# EAGLE design SparkFun_Gainer_PSoC_Dev_Board (EAGLE 7.2.0)
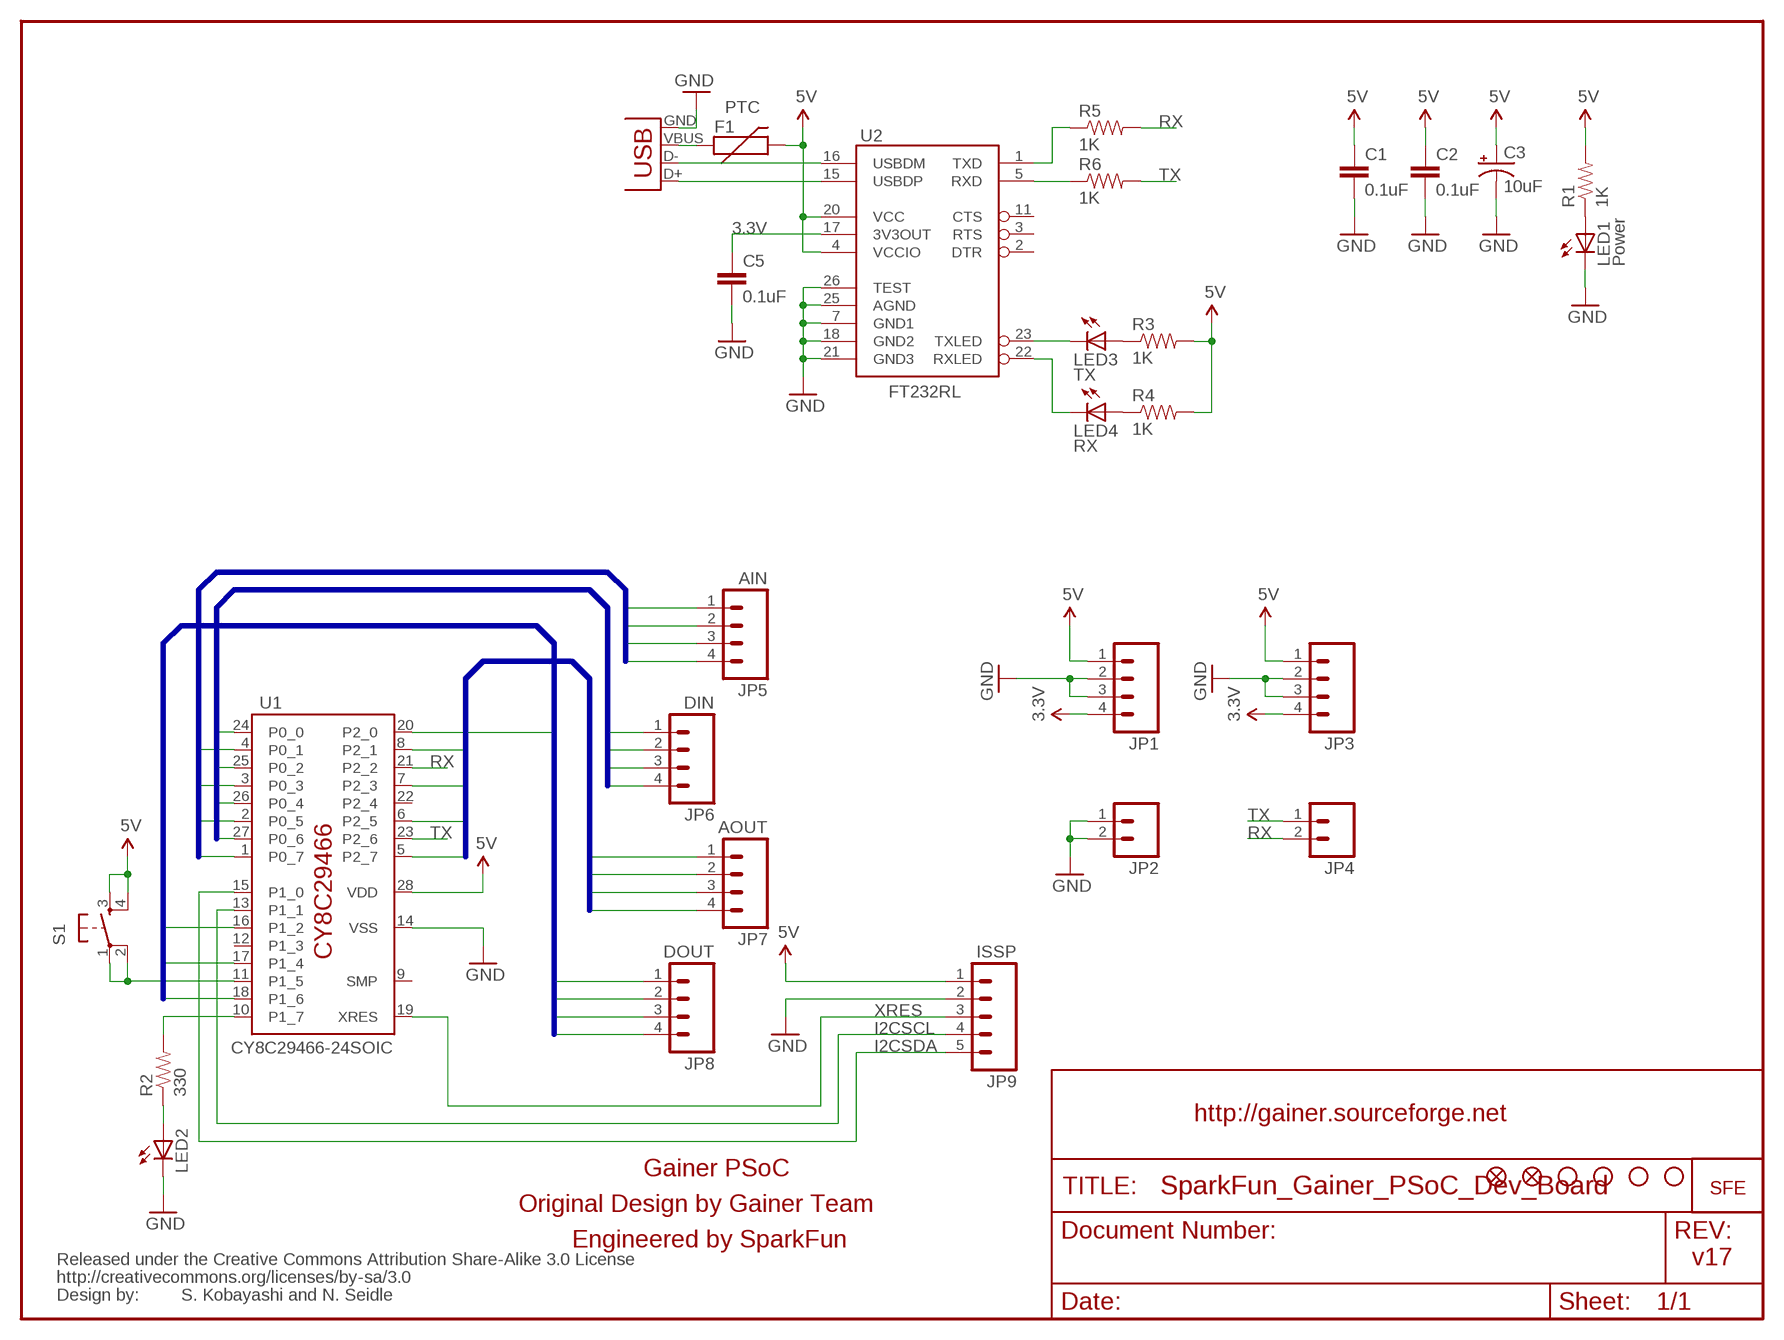
[diagram p0: schematic, sheet 1]

## Parts
C1  0.1uF  CAP0402  [C0402]
C2  0.1uF  CAP0402  [C0402]
C3  10uF  CAP_POL1206  [EIA3216]
C5  0.1uF  CAP0402  [C0402]
F1  PTC  PTCSMD  [PTC-1206]
JP1  M04PTH  [1X04]
JP2  M02PTH  [1X02]
JP3  M04PTH  [1X04]
JP4  M02PTH  [1X02]
JP5  AIN  M04PTH  [1X04]
JP6  DIN  M04PTH  [1X04]
JP7  AOUT  M04PTH  [1X04]
JP8  DOUT  M04PTH  [1X04]
JP9  ISSP  M05  [1X05]
LED1  Power  LED1206  [LED-1206]
LED2  LED1206  [LED-1206]
LED3  TX  LED0603  [LED-0603]
LED4  RX  LED0603  [LED-0603]
R1  1K  RESISTOR0402  [C0402]
R2  330  RESISTOR0402  [C0402]
R3  1K  RESISTOR0402  [C0402]
R4  1K  RESISTOR0402  [C0402]
R5  1K  RESISTOR0402  [C0402]
R6  1K  RESISTOR0402  [C0402]
S1  TAC_SWITCHSMD  [TACTILE_SWITCH_SMD]
U1  CY8C29466-24SOIC  [SOIC28]
U2  FT232RL  FT232RL-BASICSSOP  [SSOP28DB]
U$1  LOGO-SFENEW  [SFE-NEW-WEBLOGO]
U$10  FIDUCIAL1X2  [FIDUCIAL-1X2]
U$12  STAND-OFF  [STAND-OFF]
U$13  STAND-OFF  [STAND-OFF]
U$14  STAND-OFF  [STAND-OFF]
U$15  STAND-OFF  [STAND-OFF]
U$17  FIDUCIAL1X2  [FIDUCIAL-1X2]
U$18  CREATIVE_COMMONS  [CREATIVE_COMMONS]
X2  USBSMD  [USB-MINIB]

## Nets
3.3V: C5.1 JP1.4 JP3.4 U2.17(3V3OUT)
5V: C1.1 C2.1 C3.A(+) F1.2 JP1.1 JP3.1 JP9.1 R1.2 R3.2 R4.2 S1.3 S1.4 U1.28(VDD) U2.4(VCCIO) U2.20(VCC)
AIN1: JP5.1 U1.1(P0_7)
AIN2: JP5.2 U1.2(P0_5)
AIN3: JP5.3 U1.3(P0_3)
AIN4: JP5.4 U1.4(P0_1)
AOUT1: JP7.1 U1.5(P2_7)
AOUT2: JP7.2 U1.6(P2_5)
AOUT3: JP7.3 U1.7(P2_3)
AOUT4: JP7.4 U1.8(P2_1)
DIN1: JP6.1 U1.27(P0_6)
DIN2: JP6.2 U1.26(P0_4)
DIN3: JP6.3 U1.25(P0_2)
DIN4: JP6.4 U1.24(P0_0)
DOUT1: JP8.1 U1.20(P2_0)
DOUT2: JP8.2 U1.18(P1_6)
DOUT3: JP8.3 U1.17(P1_4)
DOUT4: JP8.4 U1.16(P1_2)
GND: C1.2 C2.2 C3.C(-) C5.2 JP1.2 JP1.3 JP2.1 JP2.2 JP3.2 JP3.3 JP9.2 LED1.C LED2.C U1.14(VSS) U2.7(GND1) U2.18(GND2) U2.21(GND3) U2.25(AGND) U2.26(TEST) X2.GND
I2CSCL: JP9.4 U1.13(P1_1)
I2CSDA: JP9.5 U1.15(P1_0)
N$1: LED3.A R3.1
N$2: F1.1 X2.VBUS
N$4: LED1.A R1.1
N$5: LED4.A R4.1
N$6: R6.1 U2.5(RXD)
N$7: LED4.C U2.22(RXLED)
N$8: S1.1 S1.2 U1.11(P1_5)
N$9: R2.2 U1.10(P1_7)
N$10: LED2.A R2.1
N$11: U2.16(USBDM) X2.D-
N$13: U2.15(USBDP) X2.D+
N$16: R5.1 U2.1(TXD)
N$17: LED3.C U2.23(TXLED)
RX: JP4.2 R5.2 U1.21(P2_2)
TX: JP4.1 R6.2 U1.23(P2_6)
XRES: JP9.3 U1.19(XRES)
Unconnected: U1.9(SMP) U1.12(P1_3) U1.22(P2_4) U2.2(DTR) U2.3(RTS) U2.11(CTS)

## Buses
AIN[1..4]
DIN[1..4]
AOUT[1..4]
DOUT[1..4]

## Notes on the sheet
- http://gainer.sourceforge.net
- Gainer PSoC
- Original Design by Gainer Team
- Engineered by SparkFun
- v17
- S. Kobayashi and N. Seidle

## Library data of the parts
C1 C2 C5 = SparkFun:CAP: Capacitor Standard 0603 ceramic capacitor, and 0.1" leaded capacitor.
C3 = SparkFun:CAP_POL: Capacitor Polarized These are standard SMD and PTH capacitors. Normally 10uF, 47uF, and 100uF in electrolytic and tantalum varieties. Always verify the external diameter of the through hole cap, it varies with capacity, voltage, and manufacturer. The EIA devices should be standard.
F1 = SparkFun:PTC: Resettable Fuse PTC Resettable Fuse. Spark Fun Electronics SKU : COM-08357
JP1 JP3 JP5-JP8 = SparkFun:M04: Header 4 Standard 4-pin 0.1" header. Use with straight break away headers (SKU : PRT-00116), right angle break away headers (PRT-00553), swiss pins (PRT-00743), machine pins (PRT-00117), and female headers (PRT-00115). Molex polarized connector foot print use with SKU : PRT-08231 with associated crimp pins and housings.
JP2 JP4 = SparkFun:M02: Header 2 Standard 2-pin 0.1" header. Use with straight break away headers (SKU : PRT-00116), right angle break away headers (PRT-00553), swiss pins (PRT-00743), machine pins (PRT-00117), and female headers (PRT-00115). Molex polarized connector foot print use with SKU : PRT-08233 with associated crimp pins and housings.
JP9 = SparkFun:M05: Header 5 Standard 5-pin 0.1" header. Use with straight break away headers (SKU : PRT-00116), right angle break away headers (PRT-00553), swiss pins (PRT-00743), machine pins (PRT-00117), and female headers (PRT-00115). Molex polarized connector foot print use with SKU : PRT-08230 with associated crimp pins and housings.
LED1-LED4 = SparkFun:LED: LEDs Standard schematic elements and footprints for 5mm, 3mm, 1206, and 0603 sized LEDs. 5mm - Spark Fun Electronics SKU : COM-00529 (and others)
R1-R6 = SparkFun:RESISTOR: Resistor Basic schematic elements and footprints for 0603, 1206, and PTH 1/10th watt (small) resistors.
S1 = SparkFun:TAC_SWITCH: Momentary Switch Button commonly used for reset or general input. Spark Fun Electronics SKU : COM-00097
U1 = cypress-psoc:CY8C29466-24*
U2 = SparkFun:FT232RL-BASIC: USB UART This is the simplified version of the FT232RL unit. Only what you need, nothing you don't. Spark Fun Electronics SKU : COM-00650
U$1 = SparkFun:LOGO-SFE: Spark Fun Electronics PCB Logo This is the standard Spark Fun Electronics PCB logo.
U$10 U$17 = SparkFun:FIDUCIAL: Fiducial Alignment Points Various fiducial points for machine vision alignment.
U$12-U$15 = SparkFun:STAND-OFF: Stand Off This is the mechanical footprint for a #4 phillips button head screw. Use the keepout ring to avoid running the screw head into surrounding components. SKU : PRT-00447
U$18 = SparkFun:CREATIVE_COMMONS
X2 = SparkFun:USB: USB Connectors USB-B-PTH is fully proven SKU : PRT-00139 USB-miniB is fully proven SKU : PRT-00587 USB-A-PCB is untested. USB-A-H is throughly reviewed, but untested. Spark Fun Electronics SKU : PRT-00437 USB-B-SMT is throughly reviewed, but untested. Needs silkscreen touching up. USB-A-S has not been used/tested USB-MB-H has not been used/tested

## Net classes
1 +5v: width 0.813 mm
2 GND: width 0.813 mm

## Board
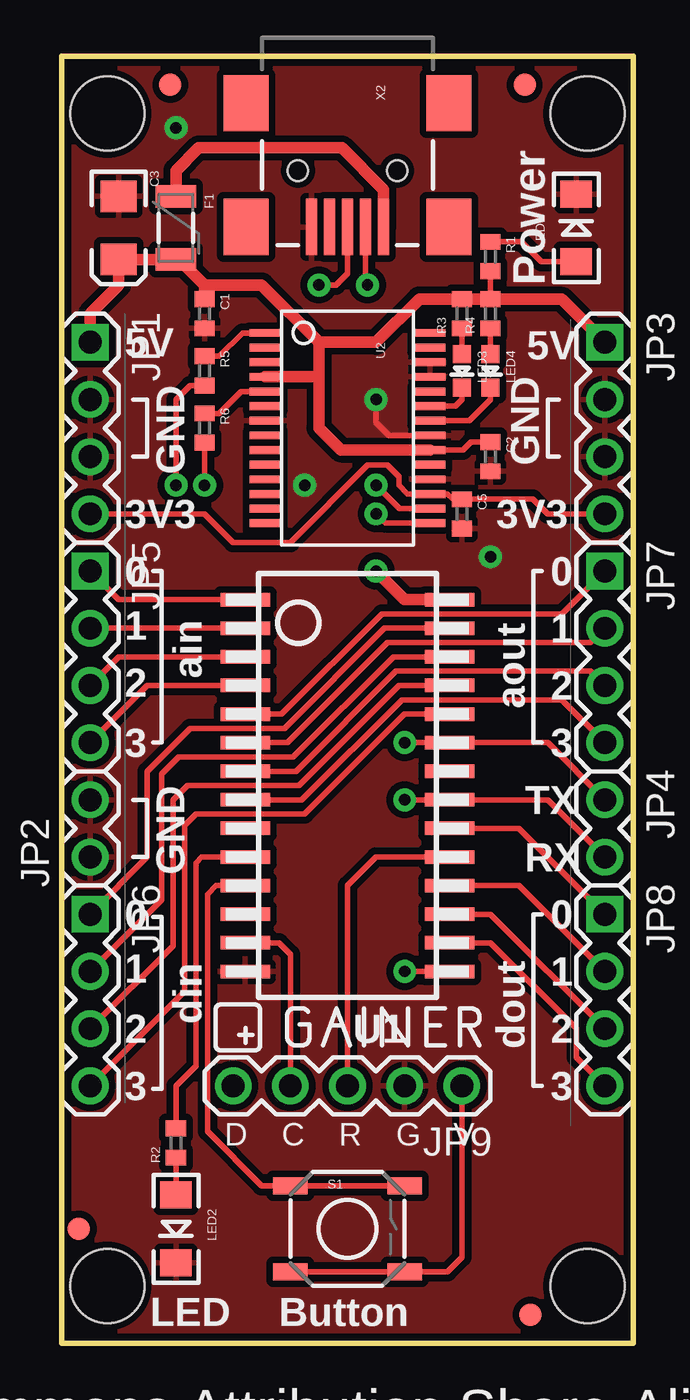
[diagram p1: board, top side]
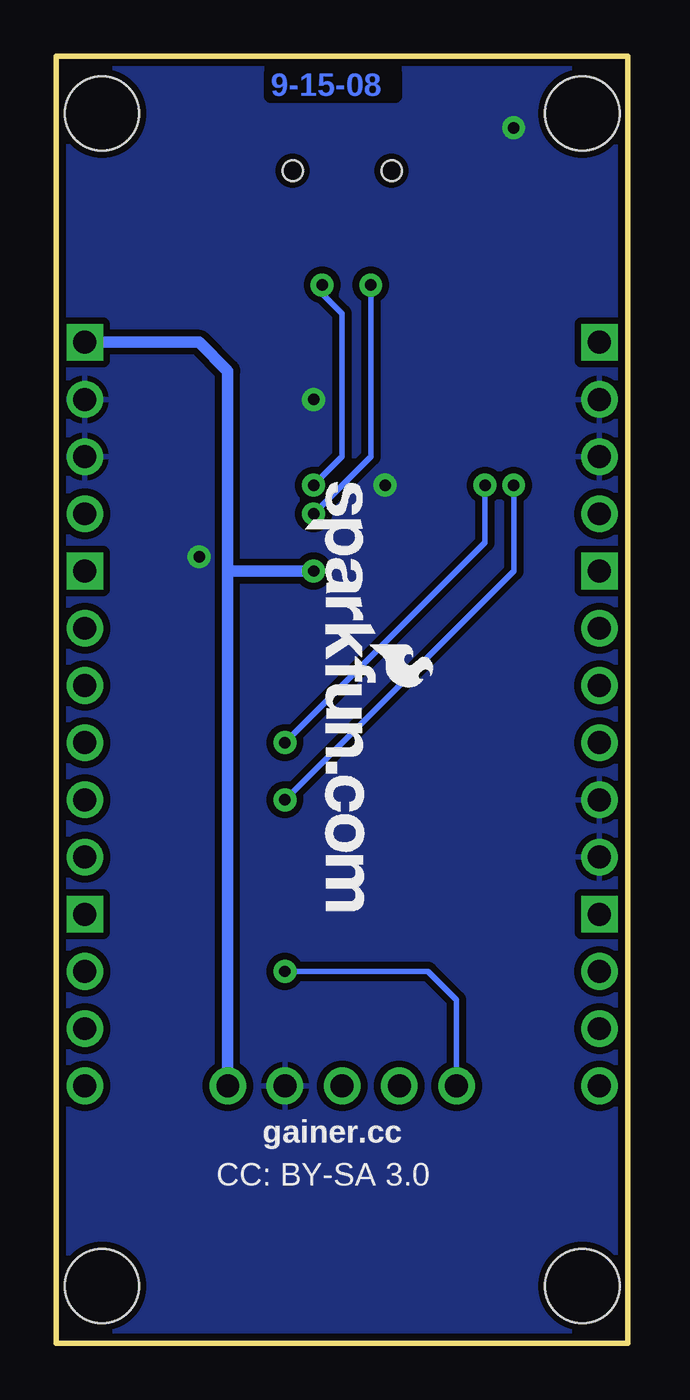
[diagram p2: board, bottom side, seen from below]

Size 25.4 x 57.15 mm. Coordinates in mm from the lower left corner, seen from the top.
Outline: 0,0 0,57.15 25.4,57.15 25.4,0 0,0
Copper layers (1*16): Top 0.035mm / dielectric 1.5mm / Bottom 0.035mm
Design rules "SparkFun": minimum track width 8mil, minimum drill 20mil, track to track 8mil, track to pad 8mil, pad to pad 8mil, via to via 8mil, smd to smd 8mil, copper to edge 10mil, drill to drill 8mil, minimum pad ring 12mil, minimum via ring 10mil, stop-mask expansion 4mil, vias tented up to drill 20mil, thermal gap 10mil

### Footprints (pad centres in the part's own frame; a part is rotated, then mirrored left to right if it is on the bottom)
C0402 = smd 0.7 x 0.9: 1 -0.65,0; 2 0.65,0
EIA3216 = smd 1.4 x 1.6: A 1.4,0; C -1.4,0
FIDUCIAL-1X2 = smd 1 x 1: 1 0,0
PTC-1206 = smd 1 x 1.8: 1 -1.4,0; 2 1.4,0
1X04 = drill 1.016 square: 1 0,0 | drill 1.016: 2 2.54,0; 3 5.08,0; 4 7.62,0
1X02 = drill 1.016: 1 0,0; 2 2.54,0
1X05 = drill 1.016: 1 0,0; 2 2.54,0; 3 5.08,0; 4 7.62,0; 5 10.16,0
LED-1206 = smd 1.2 x 1.4: A -1.5,0; C 1.5,0
LED-0603 = smd 0.8 x 0.8: A 0,-0.75; C 0,0.75
TACTILE_SWITCH_SMD = smd 1.524 x 0.762: 1 -2.54,1.905; 2 2.54,1.905; 3 -2.54,-1.905; 4 2.54,-1.905
SOIC28 = smd 0.6 x 2.2: 1 8.89,4.548; 2 7.62,4.548; 3 6.35,4.548; 4 5.08,4.548; 5 3.81,4.548; 6 2.54,4.548; 7 1.27,4.548; 8 0,4.548; 9 -1.27,4.548; 10 -2.54,4.548; 11 -3.81,4.548; 12 -5.08,4.548; 13 -6.35,4.548; 14 -7.62,4.548; 15 -7.62,-4.548; 16 -6.35,-4.548; 17 -5.08,-4.548; 18 -3.81,-4.548; 19 -2.54,-4.548; 20 -1.27,-4.548; 21 0,-4.548; 22 1.27,-4.548; 23 2.54,-4.548; 24 3.81,-4.548; 25 5.08,-4.548; 26 6.35,-4.548; 27 7.62,-4.548; 28 8.89,-4.548
SSOP28DB = smd 0.348 x 1.397: 1 -4.225,-3.656; 2 -3.575,-3.656; 3 -2.925,-3.656; 4 -2.275,-3.656; 5 -1.625,-3.656; 6 -0.975,-3.656; 7 -0.325,-3.656; 8 0.325,-3.656; 9 0.975,-3.656; 10 1.625,-3.656; 11 2.275,-3.656; 12 2.925,-3.656; 13 3.575,-3.656; 14 4.225,-3.656; 15 4.225,3.656; 16 3.575,3.656; 17 2.925,3.656; 18 2.275,3.656; 19 1.625,3.656; 20 0.975,3.656; 21 0.325,3.656; 22 -0.325,3.656; 23 -0.975,3.656; 24 -1.625,3.656; 25 -2.275,3.656; 26 -2.925,3.656; 27 -3.575,3.656; 28 -4.225,3.656
STAND-OFF = hole 3.302: 0,0
USB-MINIB = smd 2.5 x 0.5: D+ 2.5,0; D- 2.5,0.8; GND 2.5,-1.6; ID 2.5,-0.8; VBUS 2.5,1.6 | smd 2.5 x 2: GND@1 -3,-4.5; GND@2 -3,4.5; GND@3 2.5,4.5; GND@4 2.5,-4.5 | hole 0.9: 0,2.2; 0,-2.2

### Placement (x,y rotation side)
C1  6.35,45.72 270 top
C2  19.05,39.37 270 top
C3  2.54,49.53 270 top
C5  17.78,36.83 270 top
E$1  [FIDUCIAL-1X2]  20.57,55.88 0 top
E$2  [FIDUCIAL-1X2]  0.76,5.08 0 top
F1  5.08,49.53 270 top
JP1  1.27,44.45 270 top
JP2  1.27,21.59 90 top
JP3  24.13,44.45 270 top
JP4  24.13,24.13 270 top
JP5  1.27,34.29 270 top
JP6  1.27,19.05 270 top
JP7  24.13,34.29 270 top
JP8  24.13,19.05 270 top
JP9  17.78,11.43 180 top
LED1  22.86,49.53 90 top
LED2  5.08,5.08 270 top
LED3  17.78,43.18 180 top
LED4  19.05,43.18 180 top
R1  19.05,48.26 270 top
R2  5.08,8.89 90 top
R3  17.78,45.72 90 top
R4  19.05,45.72 90 top
R5  6.35,43.18 270 top
R6  6.35,40.64 270 top
S1  12.7,5.08 0 top
U1  12.7,24.13 90 top
U2  12.7,40.64 270 top
U$1  14.35,38.23 270 bottom
U$10  20.83,1.27 0 top
U$12  23.37,2.54 0 top
U$13  2.03,2.54 0 top
U$14  2.03,54.61 0 top
U$15  23.37,54.61 0 top
U$17  4.83,55.88 0 top
U$18  -19.05,-8.89 0 top  (outside the outline)
U$19  [GAINER_LOGO]  6.73,12.95 0 top
X2  12.7,52.07 270 top

### Tracks (layer width: path | path; a pad name or v marks a point on that pad's centre or on a via)
3.3V
  Top 0.254: JP1.4 6.35,36.83 7.62,35.56 10.16,35.56 13.59,38.99 14.48,38.99 14.99,38.48 14.99,38.1 15.37,37.72 U2.17 17.15,37.72 17.38,37.48 C5.1 20.94,37.48 21.59,36.83 JP3.4
5V  (via drill 0.51)
  Top 0.254: S1.3 S1.4 17.14,3.17 17.78,3.81 JP9.1 | R4.2 R1.2 | U2.20 17.82,39.66 18.18,40.02 C2.1
  Top 0.508: 19.05,46.35 22.23,46.35 JP3.1 | U2.4 11.42,42.91 11.43,42.93 | 11.43,44.45 11.43,42.93 | 11.43,44.45 13.97,44.45 15.89,46.37 R3.2 19.04,46.37 19.05,46.35 | 19.05,46.35 R4.2 | U2.20 12.4,39.66 11.43,40.64 11.43,42.93 | U1.28 15.24,33.02 v13.97,34.29 | JP1.1 1.27,45.72 2.54,46.99 C3.A | C3.A 2.54,48.26 | C3.A 4.95,48.13 5.08,48.26 F1.2 5.21,48.13 6.35,46.99 | 6.35,46.99 8.89,46.99 11.43,44.45 | 6.35,46.99 C1.1
  Bottom 0.508: JP9.1 17.78,34.29 | 17.78,34.29 17.78,43.18 19.05,44.45 JP3.1 | 17.78,34.29 v13.97,34.29
AIN1
  Top 0.254: U1.1 2.54,33.02 JP5.1
AIN2
  Top 0.254: JP5.2 U1.2
AIN3
  Top 0.254: U1.3 2.54,30.48 JP5.3
AIN4
  Top 0.254: U1.4 3.81,29.21 JP5.4
AOUT1
  Top 0.254: U1.5 9.78,27.94 14.22,32.38 22.23,32.38 JP7.1
AOUT2
  Top 0.254: U1.6 10.03,26.67 14.48,31.11 23.5,31.11 JP7.2
AOUT3
  Top 0.254: U1.7 10.41,25.4 14.86,29.84 23.5,29.84 JP7.3
AOUT4
  Top 0.254: U1.8 10.67,24.13 15.11,28.57 22.23,28.57 JP7.4
DIN1
  Top 0.254: U1.27 14.35,31.75 9.91,27.3 5.71,27.3 3.81,25.4 3.81,21.59 JP6.1
DIN2
  Top 0.254: U1.26 14.73,30.48 10.29,26.04 5.21,26.04 4.45,25.27 4.45,19.68 JP6.2
DIN3
  Top 0.254: U1.25 14.99,29.21 10.54,24.77 5.59,24.77 4.95,24.13 4.95,17.65 JP6.3
DIN4
  Top 0.254: U1.24 15.24,27.94 10.79,23.5 5.97,23.5 5.46,22.99 5.46,15.62 JP6.4
DOUT1
  Top 0.254: U1.20 20.32,22.86 JP8.1
DOUT2
  Top 0.254: U1.18 20.32,20.32 JP8.2
DOUT3
  Top 0.254: U1.17 19.05,19.05 JP8.3
DOUT4
  Top 0.254: U1.16 19.05,17.78 22.86,13.97 22.86,12.7 JP8.4
GND  (via drill 0.51)
  Top 0.254: U2.21 14.55,40.31 13.97,40.89 v13.97,41.91
  other vias: 10.79,38.1 5.08,53.98 19.05,34.92
  pour Bottom (isolate 0.305): 0,57.15 25.4,57.15 25.4,0 0,0
  pour Top (isolate 0.305): 0,57.15 25.4,57.15 25.4,0 0,0
I2CSCL
  Top 0.254: JP9.4 10.16,17.27 9.65,17.78 8.64,17.78 8.51,17.91 8.38,17.78 U1.13
I2CSDA  (via drill 0.51)
  Top 0.254: 17.4,16.51 U1.15 v15.24,16.51
  Bottom 0.254: JP9.5 7.62,15.24 8.89,16.51 v15.24,16.51
N$1
  Top 0.254: LED3.A R3.1
N$2
  Top 0.508: X2.VBUS 14.3,51.23 12.45,53.09 6.1,53.09 5.08,52.07 F1.1 5.08,50.8
N$4
  Top 0.254: R1.1 20.43,48.91 21.31,48.03 LED1.A
N$5
  Top 0.254: LED4.A R4.1
N$6
  Top 0.254: U2.5 7.97,42.27 7,41.29 R6.1
N$7
  Top 0.254: U2.22 18.11,40.97 19.05,41.91 LED4.C
N$8
  Top 0.254: U1.11 6.86,20.32 6.48,19.94 6.48,9.4 8.89,6.99 S1.1 S1.2
N$9
  Top 0.254: U1.10 6.22,21.59 5.97,21.34 5.97,12.32 5.08,11.43 R2.2
N$10
  Top 0.254: 5.08,6.48 LED2.A R2.1
N$11  (via drill 0.51)
  Top 0.254: U2.16 15.01,37.06 v13.97,38.1 | X2.D- 13.5,47.08 v13.59,46.99
  Bottom 0.254: v13.59,46.99 13.59,46.61 12.7,45.72 12.7,39.37 v13.97,38.1
N$13  (via drill 0.51)
  Top 0.254: U2.15 14.38,36.41 v13.97,36.83 | X2.D+ 12.7,47.5 12.19,46.99 v11.43,46.99
  Bottom 0.254: v11.43,46.99 11.43,39.37 v13.97,36.83
N$16
  Top 0.254: 6.35,43.81 R5.1 7,43.83 8.04,44.87 U2.1
N$17
  Top 0.254: U2.23 17.48,41.62 17.78,41.91 17.78,42.29 17.65,42.42 17.66,42.43 LED3.C
RX  (via drill 0.51)
  Top 0.254: R5.2 5.7,42.53 5.08,41.91 v5.08,38.1 | U1.21 17.27,24.13 | 17.27,24.13 v15.24,24.13 | 17.27,24.13 21.59,24.13 JP4.2
  Bottom 0.254: v5.08,38.1 5.08,34.29 v15.24,24.13
TX  (via drill 0.51)
  Top 0.254: v6.35,38.1 R6.2 | U1.23 17.27,26.67 | 17.27,26.67 v15.24,26.67 | 17.27,26.67 21.59,26.67 JP4.1
  Bottom 0.254: v6.35,38.1 6.35,35.56 v15.24,26.67
XRES
  Top 0.254: JP9.3 12.7,20.32 13.97,21.59 17.27,21.59 | 17.27,21.59 U1.19 | 17.27,21.59 17.4,21.46

### Text on the board
Bottom: 9-15-08
tPlace: Power | 5V | 5V | GND | GND | 3V3 | 3V3 | 0 | 0 | ain | 1 | 1 | 2 | 2 | aout | 3 | 3 | GND | TX | RX | 0 | 0 | din | 1 | 1 | 2 | dout | 2 | 3 | 3 | D | C | R | G | V | LED | Button | Shigeru Kobayashi
bPlace: gainer.cc | CC: BY-SA 3.0